# Altium project Function Generator.PrjPcb
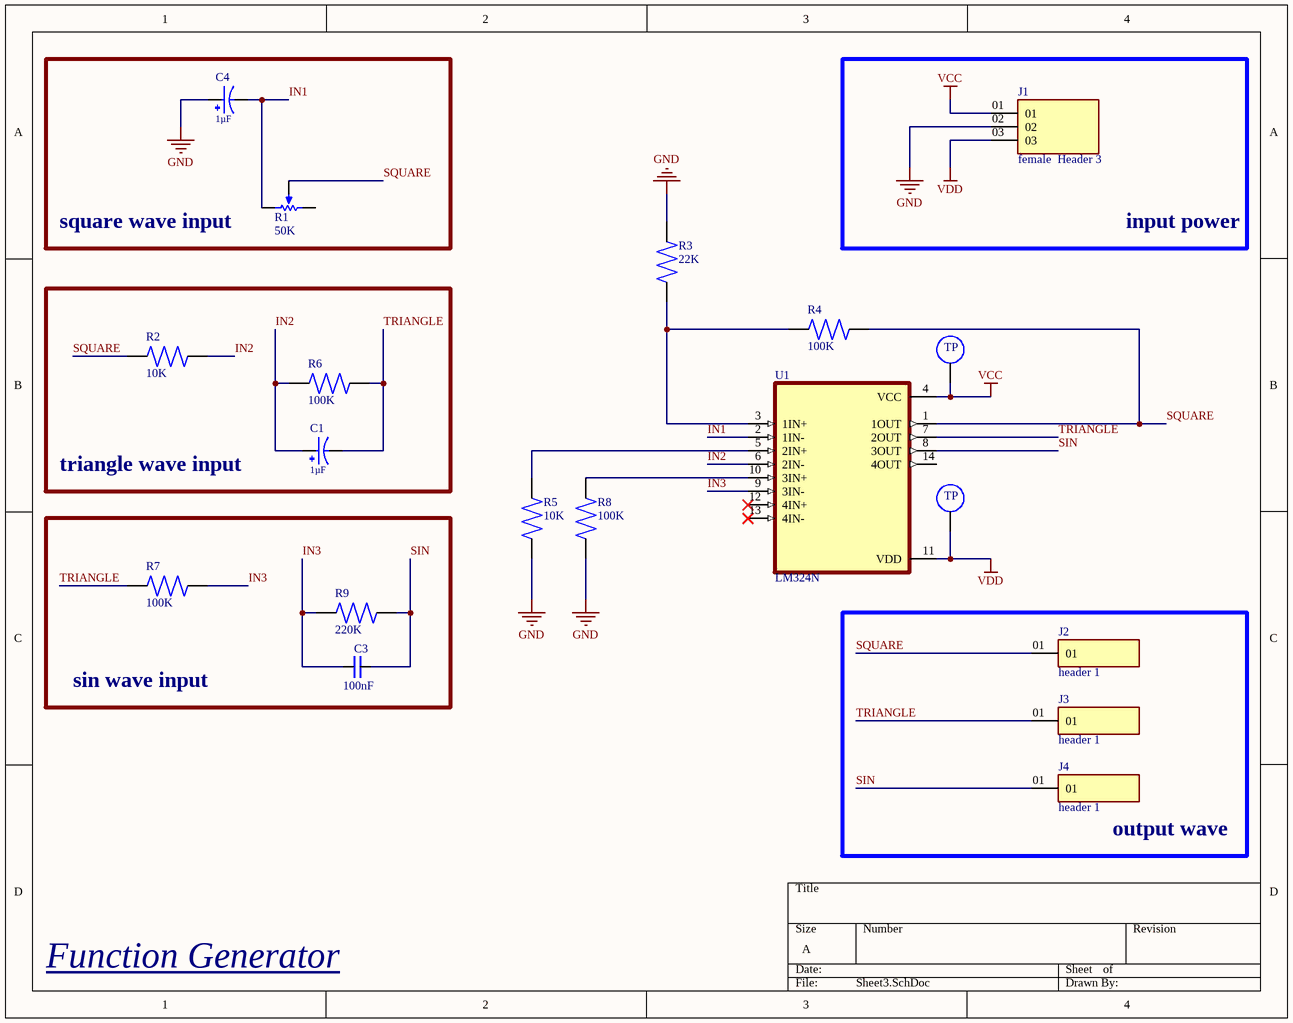
[diagram p0: Sheet3.SchDoc]
1 sheet, 19 parts. Net scope: global (net labels, ports and power ports of the same name join across sheets).
Board file: PCB1.PcbDoc

## Sheet Sheet3.SchDoc
size A; SheetNumber: 1; SheetTotal: 1

### Parts
C1  value 1µF  [CAPPRD500W50D500H1100]  (hidden comment: EEUHD1H1R0B)
C3  value 100nF  [CAPRR254W50L508T317H508]  (hidden comment: SR291C104KARTR1)
C4  value 1µF  [CAPPRD500W50D500H1100]  (hidden comment: EEUHD1H1R0B)
J1  value female  Header 3  [SAMTEC_TSW-103-19-S-S]  (hidden comment: TSW-103-19-S-S)
J2  value header 1  [SAMTEC_TMS-101-60-S-S]  (hidden comment: TMS-101-60-S-S)
J3  value header 1  [SAMTEC_TMS-101-60-S-S]  (hidden comment: TMS-101-60-S-S)
J4  value header 1  [SAMTEC_TMS-101-60-S-S]  (hidden comment: TMS-101-60-S-S)
R1  value 50K  [33262M trimpot]  (hidden comment: 3362 trimpot)
R2  value 10K  [RESAD1081W64L635D269]  (hidden comment: RNC55H1003FMB14)
R3  value 22K  [RESAD1081W64L635D269]  (hidden comment: RNC55H1003FMB14)
R4  value 100K  [RESAD1081W64L635D269]  (hidden comment: RNC55H1003FMB14)
R5  value 10K  [RESAD1081W64L635D269]  (hidden comment: RNC55H1003FMB14)
R6  value 100K  [RESAD1081W64L635D269]  (hidden comment: RNC55H1003FMB14)
R7  value 100K  [RESAD1081W64L635D269]  (hidden comment: RNC55H1003FMB14)
R8  value 100K  [RESAD1081W64L635D269]  (hidden comment: RNC55H1003FMB14)
R9  value 220K  [RESAD1081W64L635D269]  (hidden comment: RNC55H1003FMB14)
U1  LM324N  [DIP794W45P254L1969H508Q14]
VCC  TEST POINT  [TEST POINT]  (value not drawn)  (no BOM)
VDD  TEST POINT  [TEST POINT]  (value not drawn)  (no BOM)

### Blocks framed on the sheet
square wave input: C4 R1
input power: J1
triangle wave input: C1 R2 R6
sin wave input: C3 R7 R9
output wave: J2-J4

### Nets
GND: C4.P J1.02 R3.2 R5.1 R8.1
VCC: J1.01 U1.4(VCC) VCC.1
VDD: J1.03 U1.11(VDD) VDD.1
IN1: C4.N R1.2(BOT) U1.2(1IN-)
IN2: C1.P R2.2 R6.2 U1.6(2IN-)
IN3: C3.1 R7.2 R9.1 U1.9(3IN-)
SIN: C3.2 J4.01 R9.2 U1.8(3OUT)
SQUARE: J2.01 R1.3(TAP) R2.1 R4.2 U1.1(1OUT)
TRIANGLE: C1.N J3.01 R6.1 R7.1 U1.7(2OUT)
NetR3_1: R3.1 R4.1 U1.3(1IN+)
NetR5_2: R5.2 U1.5(2IN+)
NetR8_2: R8.2 U1.10(3IN+)

Not connected (* = marked no-connect by the designer): R1 1(TOP); U1 12(4IN+)* 13(4IN-)* 14(4OUT)

### Notes on the sheet
- Function Generator
- (in symbol TEST POINT) TP

### Library data of the parts
C1 C4 = EEUHD1H1R0B: Cap Aluminum Lytic 1uF 50V 20% (5 X 11mm) Radial 5mm 10mA 1000h 105Â°C Automotive Ammo; MF: Panasonic; Package: RADIAL-2 Panasonic; Price: None; Check_prices: https://www.snapeda.com/parts/EEUHD1H1R0B/Panasonic/view-part/5786221/?ref=eda; MP: EEUHD1H1R0B; SnapEDA_Link: https://www.snapeda.com/parts/EEUHD1H1R0B/Panasonic/view-part/5786221/?ref=snap; Availability: In Stock
C3 = SR291C104KARTR1: Capacitor, Ceramic, 100nF, 100VDC, 10-% Tol, 10+% Tol, X7R-TC Code, -15, 15%-TC; MF: AVX; SnapEDA_Link: https://www.snapeda.com/parts/SR291C104KARTR1/AVX/view-part/?ref=snap; Package: Radial AVX; MP: SR291C104KARTR1; Check_prices: https://www.snapeda.com/parts/SR291C104KARTR1/AVX/view-part/?ref=eda
R1 = 3362 trimpot: 3362M Timpot; Sim Note: Enter the Resistance value and the set point into parameter fields.; Set Position: 0.5; Published: 8-Jun-2000; LatestRevisionDate: 17-Jul-2002; LatestRevisionNote: Re-released for DXP Platform.; PackageReference: VR5; Publisher: Altium Limited; PackageDescription: Variable Resistor, Thru-Hole; 3 Leads
R2-R9 = RNC55H1003FMB14: RES 100K OHM 1/8W 1% AXIAL; MF: Vishay Dale; MP: RNC55H1003FMB14; SnapEDA_Link: https://www.snapeda.com/parts/RNC55H1003FMB14/Vishay+Dale/view-part/?ref=snap; Availability: In Stock; Check_prices: https://www.snapeda.com/parts/RNC55H1003FMB14/Vishay+Dale/view-part/?ref=eda; Package: None; Price: None; Purchase-URL: https://pricing.snapeda.com/search/part/RNC55H1003FMB14/?ref=eda
U1 = LM324N: General Purpose Amplifier 4 Circuit - 14-MDIP; MF: ON Semiconductor; SnapEDA_Link: https://www.snapeda.com/parts/LM324N/Onsemi/view-part/?ref=snap; Package: DIP-14 Motorola; MP: LM324N; Check_prices: https://www.snapeda.com/parts/LM324N/Onsemi/view-part/?ref=eda; Purchase-URL: https://pricing.snapeda.com/search/part/LM324N/?ref=eda; Price: None; Value: *; Availability: In Stock
J1 = TSW-103-19-S-S: Package: None; Price: None; MP: TSW-103-19-S-S; Availability: Unavailable
J2-J4 = TMS-101-60-S-S: Package: None; Price: None; MP: TMS-101-60-S-S; Availability: Unavailable